# Altium project ATmega_2560_Pro.PrjPcb (part 1 of 4)
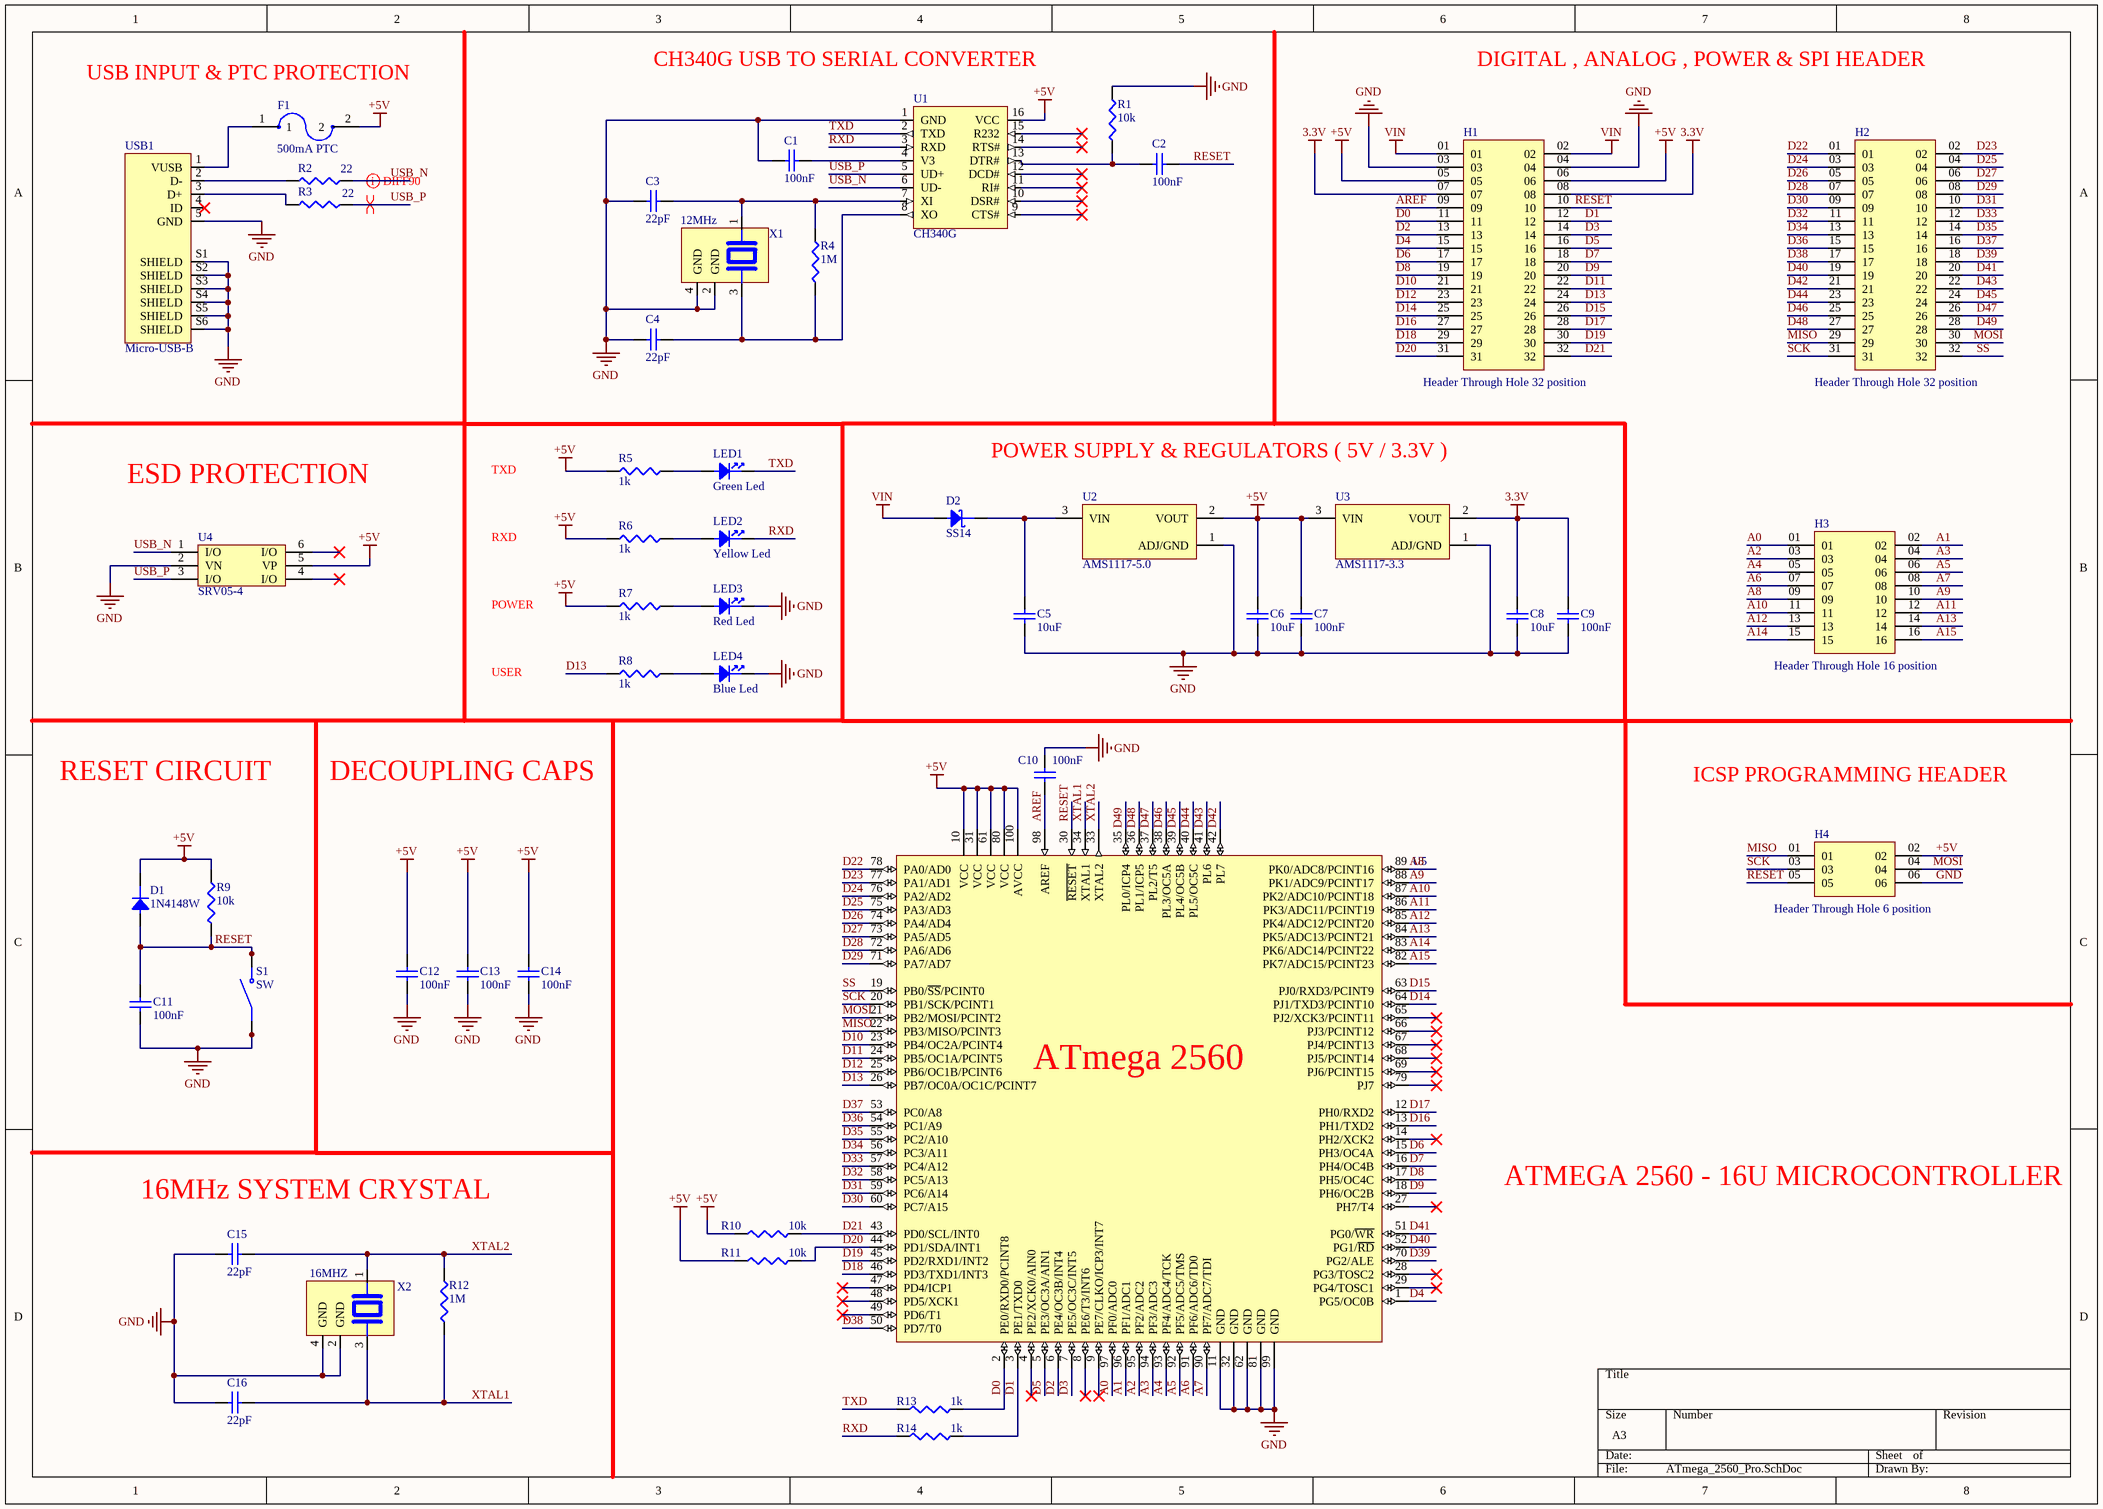
[diagram p0: ATmega_2560_Pro.SchDoc]
1 sheet, 50 parts. Net scope: global (net labels, ports and power ports of the same name join across sheets).
Board file: ATmega_2560_Pro.PcbDoc

## Sheet ATmega_2560_Pro.SchDoc
size A3; SheetNumber: 1; SheetTotal: 1

### Parts
C1  100nF  [CAPC1608X90 - 100NF]
C2  100nF  [CAPC1608X90 - 100NF]
C3  22pF  [CAPC1608X90 - 22PF]
C4  22pF  [CAPC1608X90 - 22PF]
C5  10uF  [CAPC1608X90 - 10UF]
C6  10uF  [CAPC1608X90 - 10UF]
C7  100nF  [CAPC1608X90 - 100NF]
C8  10uF  [CAPC1608X90 - 10UF]
C9  100nF  [CAPC1608X90 - 100NF]
C10  100nF  [CAPC1608X90 - 100NF]
C11  100nF  [CAPC1608X90 - 100NF]
C12  100nF  [CAPC1608X90 - 100NF]
C13  100nF  [CAPC1608X90 - 100NF]
C14  100nF  [CAPC1608X90 - 100NF]
C15  22pF  [CAPC1608X90 - 22PF]
C16  22pF  [CAPC1608X90 - 22PF]
D1  1N4148W  [SOD123_DIO]
D2  SS14  [DIOM4325X250N]
F1  500mA PTC  [FUSM4632X85]
H1  Header Through Hole 32 position  [SAMTEC_TSW-116-07-G-D]
H2  Header Through Hole 32 position  [SAMTEC_TSW-116-07-G-D]
H3  Header Through Hole 16 position  [SAMTEC_TSW-108-07-G-D]
H4  Header Through Hole 6 position  [SAMTEC_TSW-103-07-G-D]
LED1  Green Led  [WL-SMCW_0603-G]
LED2  Yellow Led  [WL-SMCW_0603-Y]
LED3  Red Led  [WL-SMCW_0603-R]
LED4  Blue Led  [WL-SMCW_0603-B]
R1  10k  [RESC1607X60N - 10K]
R2  22  [RESC1607X60N - 22]
R3  22  [RESC1607X60N - 22]
R4  1M  [RESC1607X60N - 1M]
R5  1k  [RESC1607X60N - 1K]
R6  1k  [RESC1607X60N - 1K]
R7  1k  [RESC1607X60N - 1K]
R8  1k  [RESC1607X60N - 1K]
R9  10k  [RESC1607X60N - 10K]
R10  10k  [RESC1607X60N - 10K]
R11  10k  [RESC1607X60N - 10K]
R12  1M  [RESC1607X60N - 1M]
R13  1k  [RESC1607X60N - 1K]
R14  1k  [RESC1607X60N - 1K]
S1  SW  [SW_TS-1187A-B-A-B]
U1  CH340G  [SOP127P780X200-16N]
U2  AMS1117-5.0  [SOT229P700X180-4N-5.0]
U3  AMS1117-3.3  [SOT229P700X180-4N-3.3]
U4  SRV05-4  [TSOP6_3P1X1P7_ONS]
U5  ATMEGA2560-16AU  [QFP50P1600X1600X120-100N]  (value not drawn)
USB1  Micro-USB-B  [AMPHENOL_10118193-0001LF]
X1  12MHz  [OSCCC250X320X70-4N]
X2  16MHZ  [XTAL_7M-16.000MAAJ-T]

### Nets
3.3V: C8.2 C9.2 H1.07 H1.08 U3.2(VOUT)
+5V: C6.2 C7.2 C12.2 C13.2 C14.2 D1.1 F1.2 H1.05 H1.06 H4.02 R5.1 R6.1 R7.1 R9.2 R10.2 R11.2 U1.16(VCC) U2.2(VOUT) U3.3(VIN) U4.5(VP) U5.10(VCC) U5.31(VCC) U5.61(VCC) U5.80(VCC) U5.100(AVCC)
GND: C1.1 C3.1 C4.1 C5.1 C6.1 C7.1 C8.1 C9.1 C10.2 C11.1 C12.1 C13.1 C14.1 C15.1 C16.1 H1.03 H1.04 H4.06 LED3.C LED4.C R1.2 S1.A(COM) S1.B(COM) U1.1(GND) U2.1(ADJ/GND) U3.1(ADJ/GND) U4.2(VN) U5.11(GND) U5.32(GND) U5.62(GND) U5.81(GND) U5.99(GND) USB1.5(GND) USB1.S1(SHIELD) USB1.S2(SHIELD) USB1.S3(SHIELD) USB1.S4(SHIELD) USB1.S5(SHIELD) USB1.S6(SHIELD) X1.2(GND) X1.4(GND) X2.2(GND) X2.4(GND)
VIN: D2.A H1.01 H1.02
A0: H3.01 U5.97(PF0/ADC0)
A1: H3.02 U5.96(PF1/ADC1)
A2: H3.03 U5.95(PF2/ADC2)
A3: H3.04 U5.94(PF3/ADC3)
A4: H3.05 U5.93(PF4/ADC4/TCK)
A5: H3.06 U5.92(PF5/ADC5/TMS)
A6: H3.07 U5.91(PF6/ADC6/TD0)
A7: H3.08 U5.90(PF7/ADC7/TDI)
A8: H3.09 U5.89(PK0/ADC8/PCINT16)
A9: H3.10 U5.88(PK1/ADC9/PCINT17)
A10: H3.11 U5.87(PK2/ADC10/PCINT18)
A11: H3.12 U5.86(PK3/ADC11/PCINT19)
A12: H3.13 U5.85(PK4/ADC12/PCINT20)
A13: H3.14 U5.84(PK5/ADC13/PCINT21)
A14: H3.15 U5.83(PK6/ADC14/PCINT22)
A15: H3.16 U5.82(PK7/ADC15/PCINT23)
AREF: C10.1 H1.09 U5.98(AREF)
D0: H1.11 R13.2 U5.2(PE0/RXD0/PCINT8)
D1: H1.12 R14.2 U5.3(PE1/TXD0)
D2: H1.13 U5.6(PE4/OC3B/INT4)
D3: H1.14 U5.7(PE5/OC3C/INT5)
D4: H1.15 U5.1(PG5/OC0B)
D5: H1.16 U5.5(PE3/OC3A/AIN1)
D6: H1.17 U5.15(PH3/OC4A)
D7: H1.18 U5.16(PH4/OC4B)
D8: H1.19 U5.17(PH5/OC4C)
D9: H1.20 U5.18(PH6/OC2B)
D10: H1.21 U5.23(PB4/OC2A/PCINT4)
D11: H1.22 U5.24(PB5/OC1A/PCINT5)
D12: H1.23 U5.25(PB6/OC1B/PCINT6)
D13: H1.24 R8.1 U5.26(PB7/OC0A/OC1C/PCINT7)
D14: H1.25 U5.64(PJ1/TXD3/PCINT10)
D15: H1.26 U5.63(PJ0/RXD3/PCINT9)
D16: H1.27 U5.13(PH1/TXD2)
D17: H1.28 U5.12(PH0/RXD2)
D18: H1.29 U5.46(PD3/TXD1/INT3)
D19: H1.30 U5.45(PD2/RXD1/INT2)
D20: H1.31 R11.1 U5.44(PD1/SDA/INT1)
D21: H1.32 R10.1 U5.43(PD0/SCL/INT0)
D22: H2.01 U5.78(PA0/AD0)
D23: H2.02 U5.77(PA1/AD1)
D24: H2.03 U5.76(PA2/AD2)
D25: H2.04 U5.75(PA3/AD3)
D26: H2.05 U5.74(PA4/AD4)
D27: H2.06 U5.73(PA5/AD5)
D28: H2.07 U5.72(PA6/AD6)
D29: H2.08 U5.71(PA7/AD7)
D30: H2.09 U5.60(PC7/A15)
D31: H2.10 U5.59(PC6/A14)
D32: H2.11 U5.58(PC5/A13)
D33: H2.12 U5.57(PC4/A12)
D34: H2.13 U5.56(PC3/A11)
D35: H2.14 U5.55(PC2/A10)
D36: H2.15 U5.54(PC1/A9)
D37: H2.16 U5.53(PC0/A8)
D38: H2.17 U5.50(PD7/T0)
D39: H2.18 U5.70(PG2/ALE)
D40: H2.19 U5.52(PG1/~{RD})
D41: H2.20 U5.51(PG0/~{WR})
D42: H2.21 U5.42(PL7)
D43: H2.22 U5.41(PL6)
D44: H2.23 U5.40(PL5/OC5C)
D45: H2.24 U5.39(PL4/OC5B)
D46: H2.25 U5.38(PL3/OC5A)
D47: H2.26 U5.37(PL2/T5)
D48: H2.27 U5.36(PL1/ICP5)
D49: H2.28 U5.35(PL0/ICP4)
MISO: H2.29 H4.01 U5.22(PB3/MISO/PCINT3)
MOSI: H2.30 H4.04 U5.21(PB2/MOSI/PCINT2)
RESET: C2.2 C11.2 D1.2 H1.10 H4.05 R9.1 S1.C(NO) S1.D(NO) U5.30(~{RESET})
RXD: LED2.C R14.1 U1.3(RXD)
SCK: H2.31 H4.03 U5.20(PB1/SCK/PCINT1)
SS: H2.32 U5.19(PB0/~{SS}/PCINT0)
TXD: LED1.C R13.1 U1.2(TXD)
USB_N: R2.2 U1.6(UD-) U4.1(I/O)
USB_P: R3.2 U1.5(UD+) U4.3(I/O)
XTAL1: C16.2 R12.1 U5.34(XTAL1) X2.3
XTAL2: C15.2 R12.2 U5.33(XTAL2) X2.1
NetC1_2: C1.2 U1.4(V3)
NetC2_1: C2.1 R1.1 U1.13(DTR#)
NetC3_2: C3.2 R4.2 U1.7(XI) X1.1
NetC4_2: C4.2 R4.1 U1.8(XO) X1.3
NetC5_2: C5.2 D2.C U2.3(VIN)
NetF1_1: F1.1 USB1.1(VUSB)
NetLED1_A: LED1.A R5.2
NetLED2_A: LED2.A R6.2
NetLED3_A: LED3.A R7.2
NetLED4_A: LED4.A R8.2
NetR2_1: R2.1 USB1.2(D-)
NetR3_1: R3.1 USB1.3(D+)

Not connected (* = marked no-connect by the designer): U1 9(CTS#)* 10(DSR#)* 11(RI#)* 12(DCD#)* 14(RTS#)* 15(R232)*; U4 4(I/O)* 6(I/O)*; U5 4(PE2/XCK0/AIN0)* 8(PE6/T3/INT6)* 9(PE7/CLKO/ICP3/INT7)* 14(PH2/XCK2)* 27(PH7/T4)* 28(PG3/TOSC2)* 29(PG4/TOSC1)* 47(PD4/ICP1)* 48(PD5/XCK1)* 49(PD6/T1)* 65(PJ2/XCK3/PCINT11)* 66(PJ3/PCINT12)* 67(PJ4/PCINT13)* 68(PJ5/PCINT14)* 69(PJ6/PCINT15)* 79(PJ7)*; USB1 4(ID)*

### Layout directives
differential pair; differential pair class Diff90: USB_N, USB_P

### Notes on the sheet
- (near F1) USB INPUT & PTC PROTECTION
- (near U1) CH340G USB TO SERIAL CONVERTER
- DIGITAL , ANALOG , POWER & SPI HEADER
- ESD PROTECTION
- TXD
- POWER SUPPLY & REGULATORS ( 5V / 3.3V )
- RXD
- POWER
- USER
- RESET CIRCUIT
- DECOUPLING CAPS
- ICSP PROGRAMMING HEADER
- ATMEGA 2560 - 16U MICROCONTROLLER
- (near C15) 16MHz SYSTEM CRYSTAL
- (in symbol ATMEGA2560-16AU) ATmega 2560